# EAGLE design power (EAGLE 9.2.2)
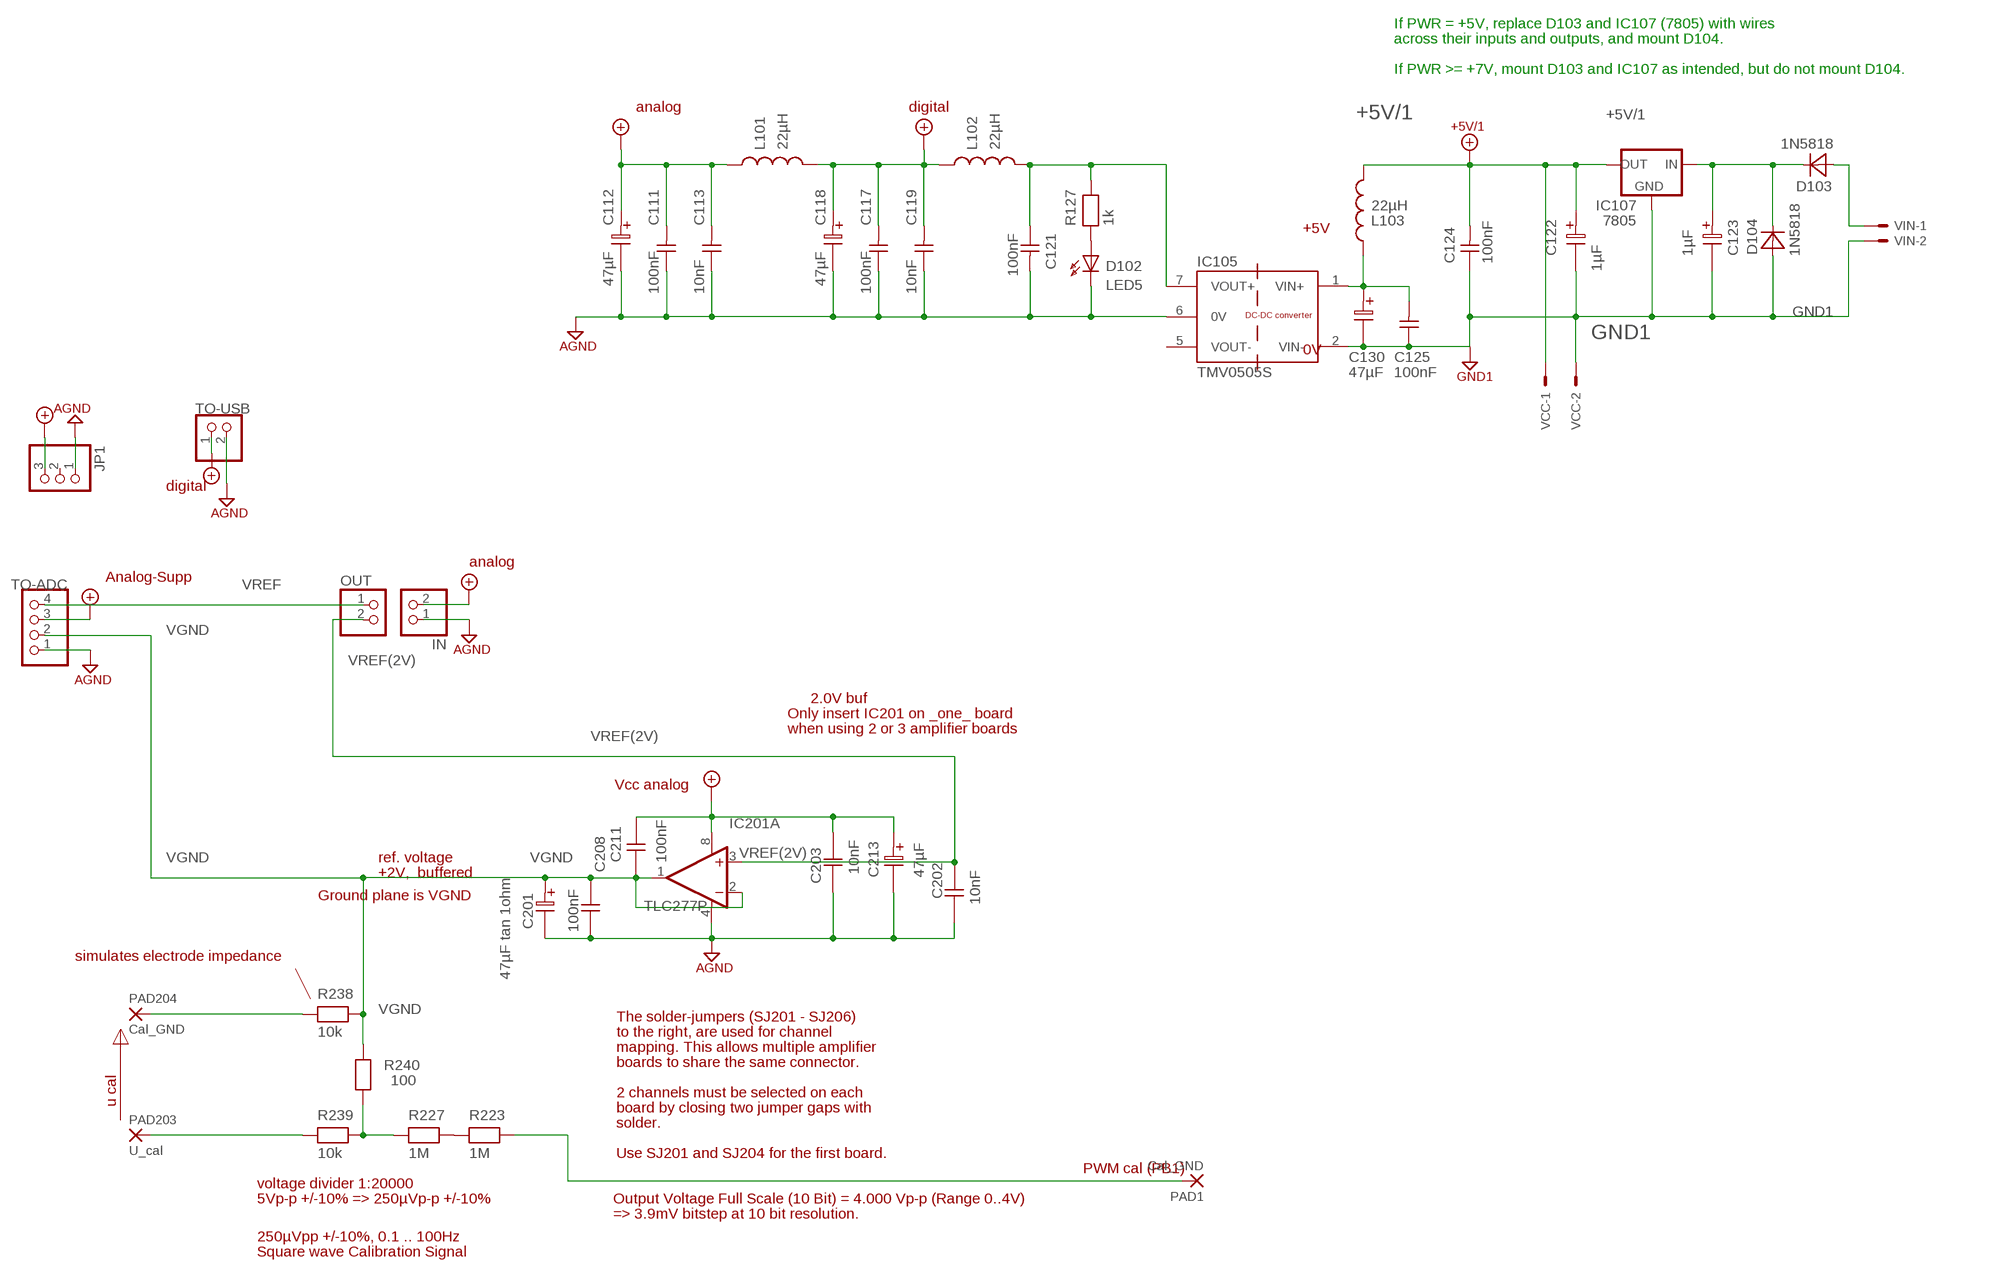
[diagram p0: schematic, sheet 1]

## Parts
C111  100nF  CAPNP-5  [C-5]
C112  47µF  ELC-5  [EL25B]
C113  10nF  CAPNP-5  [C-5]
C117  100nF  CAPNP-5  [C-5]
C118  47µF  ELC-5  [EL25B]
C119  10nF  CAPNP-5  [C-5]
C121  100nF  CAPNP-5@2  [C-5@1]
C122  1µF  ELC-2,5  [EL25B]
C123  1µF  ELC-2,5  [EL25B]
C124  100nF  CAPNP-5@2  [C-5@1]
C125  100nF  CAPNP-5  [C-5]
C130  47µF  ELC-5  [EL25B]
C201  47µF tan 1ohm  ELC-2,5  [EL25B]
C202  10nF  CAPNP-5@2  [C-5]
C203  10nF  CAPNP-7,5  [C-5]
C208  100nF  CAPNP-7,5  [C-5]
C211  100nF  CAPNP-5@2  [C-5]
C213  47µF  ELC-5  [EL25B]
D102  LED5  [LED5]
D103  1N5818  DIODE-12,5  [D-12,5]
D104  1N5818  DIODE-12,5  [D-12,5]
IC105  TMV0505S  MEJ2D0505SC  [MEJDCDC-SC]
IC107  7805  78XXS  [78XXL_S]
IC201  TLC277P  OPA2604AP  [DIL-08]
IN  PINHD-1X2  [1X02]
JP1  PINHD-1X3  [1X03]
L101  22µH  L-10  [R-12,5]
L102  22µH  L-10  [R-12,5]
L103  22µH  L-10  [R-12,5]
OUT  PINHD-1X2  [1X02]
PAD1  Cal_GND  1,6/0,8  [WIREPAD1]
PAD203  U_cal  1,6/0,8  [WIREPAD1]
PAD204  Cal_GND  1,6/0,8  [WIREPAD1]
R127  1k  RESEU-10@2  [R-10]
R223  1M  RESEU-10@2  [R-10]
R227  1M  RESEU-10@2  [R-10]
R238  10k  RESEU-7,5  [R-10]
R239  10k  RESEU-7,5  [R-10]
R240  100  RESEU-7,5  [R-10]
TO-ADC  PINHD-1X4  [1X04]
TO-USB  PINHD-1X2  [1X02]
VCC  87758-0216  [87758-0216]
VIN  22-23-2021  [22-23-2021]

## Nets
+5V/1: C122.1 C124.2 IC107.OUT L103.2 VCC.1
+6TO12V: C123.1 D103.2(K) D104.2(K) IC107.IN
A-VCC: C111.2 C112.1 C113.2 C203.1 C211.2 C213.1 IC201.8(A:V+) IN.2 L101.1 TO-ADC.3 ; supply symbol labelled +5V/2
D-VCC: C117.2 C118.1 C119.2 JP1.3 L101.2 L102.1 TO-USB.1 ; supply symbol labelled +5V/3
GND: C111.1 C112.2 C113.1 C117.1 C118.2 C119.1 C121.2 C201.2 C202.2 C203.2 C208.2 C213.2 D102.K IC105.6(0V) IC201.4(A:V-) IN.1 JP1.1 TO-ADC.1 TO-USB.2 ; supply symbol labelled AGND
GND1: C122.2 C123.2 C124.1 C125.1 C130.2 D104.1(A) IC105.2(VIN-) IC107.GND VCC.2 VIN.2
N$14: C121.1 IC105.7(VOUT+) L102.2 R127.2
N$15: D102.A R127.1
N$18: D103.1(A) VIN.1
N$30: PAD204.1(P) R238.1
N$34: R227.1 R239.2 R240.2
N$44: C125.2 C130.1 IC105.1(VIN+) L103.1
N$46: R223.1 R227.2
N$48: PAD203.1(P) R239.1
PWM: PAD1.1(P) R223.2
VGND: C201.1 C208.1 C211.1 IC201.1(A:OUT) IC201.2(A:-IN) R238.2 R240.1 TO-ADC.2
VREF: OUT.1 TO-ADC.4
VREF(2V): C202.1 IC201.3(A:+IN) OUT.2
Unconnected: IC201.5(B:+IN) IC201.6(B:-IN) IC201.7(B:OUT) JP1.2

## Notes on the sheet
- If PWR = +5V, replace D103 and IC107 (7805) with wires
- across their inputs and outputs, and mount D104.
- If PWR >= +7V, mount D103 and IC107 as intended, but do not mount D104.
- analog | digital
- +5V
- 0V
- digital
- analog
- Analog-Supp
- 2.0V buf
- Only insert IC201 on _one_ board
- when using 2 or 3 amplifier boards
- Vcc analog
- ref. voltage
- +2V,  buffered
- Ground plane is VGND
- simulates electrode impedance
- The solder-jumpers (SJ201 - SJ206)
- to the right, are used for channel
- mapping. This allows multiple amplifier
- boards to share the same connector.
- u cal
- 2 channels must be selected on each
- board by closing two jumper gaps with
- solder.
- Use SJ201 and SJ204 for the first board.
- PWM cal (PB1)
- voltage divider 1:20000
- 5Vp-p +/-10% => 250µVp-p +/-10% | Output Voltage Full Scale (10 Bit) = 4.000 Vp-p (Range 0..4V)
- => 3.9mV bitstep at 10 bit resolution.
- 250µVpp +/-10%, 0.1 .. 100Hz
- Square wave Calibration Signal

## Power pins joined to a net without a drawn wire
VOUT-: IC105.5(VOUT-)

## Library data of the parts
C111 C113 C117 C119 C125 = discrete:CAPNP-5
C112 C118 C130 = discrete:ELC-5
C121 C124 = discrete:CAPNP-5@2
C122 C123 = DISCRETE@2:ELC-2,5
C201 = DISCRETE@3:ELC-2,5
C202 C211 = DISCRETE:CAPNP-5@2
C203 C208 = DISCRETE:CAPNP-7,5
C213 = DISCRETE@2:ELC-5
D102 = led:LED5
D103 D104 = discrete:DIODE-12,5
IC105 = modEEG:MEJ2D0505SC
IC107 = V-REG@2:78XXS
IC201 = BURR:OPA2604AP
IN OUT TO-USB = pinhead:PINHD-1X2: PIN HEADER
JP1 = pinhead:PINHD-1X3: PIN HEADER
L101-L103 = DISCRETE@2:L-10
PAD1 PAD203 PAD204 = WIREPAD@2:1,6/0,8
R127 = discrete:RESEU-10@2
R223 R227 = DISCRETE:RESEU-10@2
R238-R240 = DISCRETE:RESEU-7,5
TO-ADC = pinhead:PINHD-1X4: PIN HEADER
VCC = con-molex:87758-0216: 2 Pin - 2mm Dual Row Single Wafer, Vertical T/H HDR Source: http://www.molex.com/pdm_docs/sd/877580616_sd.pdf; MF: MOLEX; MPN: 87758-0216; OC_FARNELL: unknown; OC_NEWARK: 94M1513
VIN = con-molex:22-23-2021: .100" (2.54mm) Center Header - 2 Pin; MF: MOLEX; MPN: 22-23-2021; OC_FARNELL: 1462926; OC_NEWARK: 25C3832

## Board
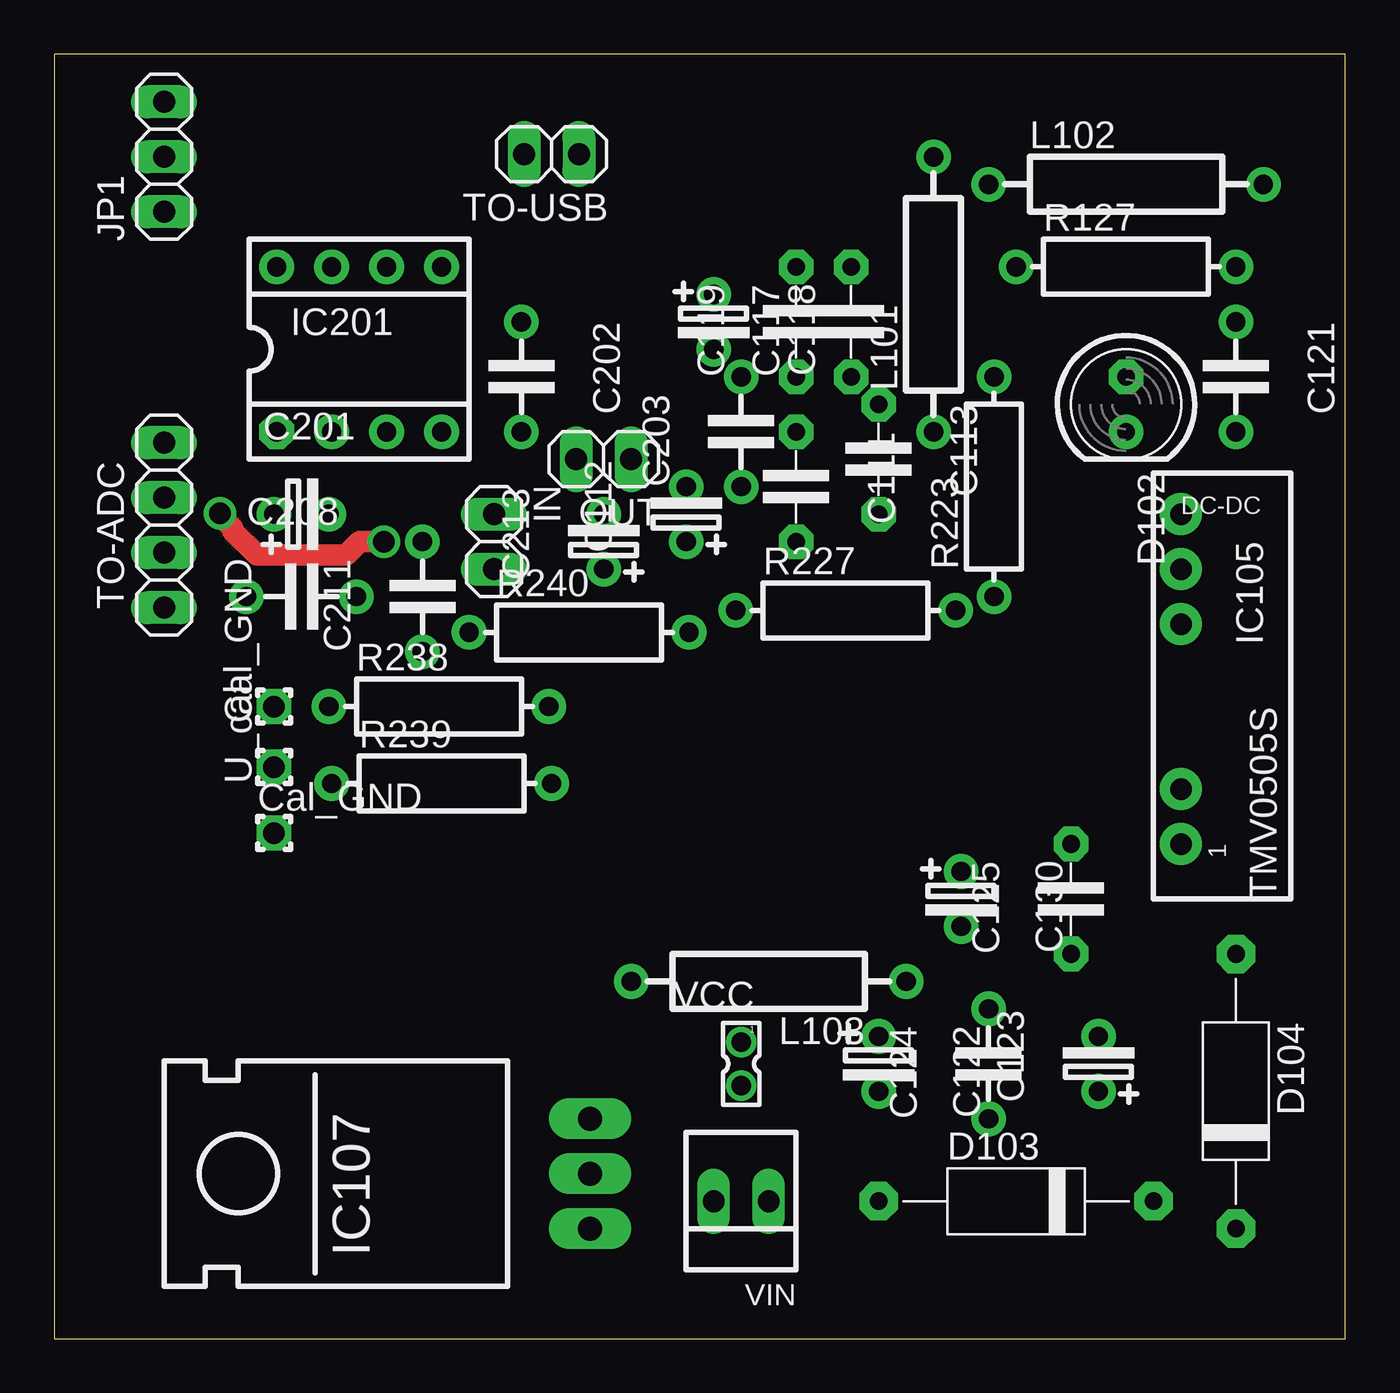
[diagram p1: board, top side]
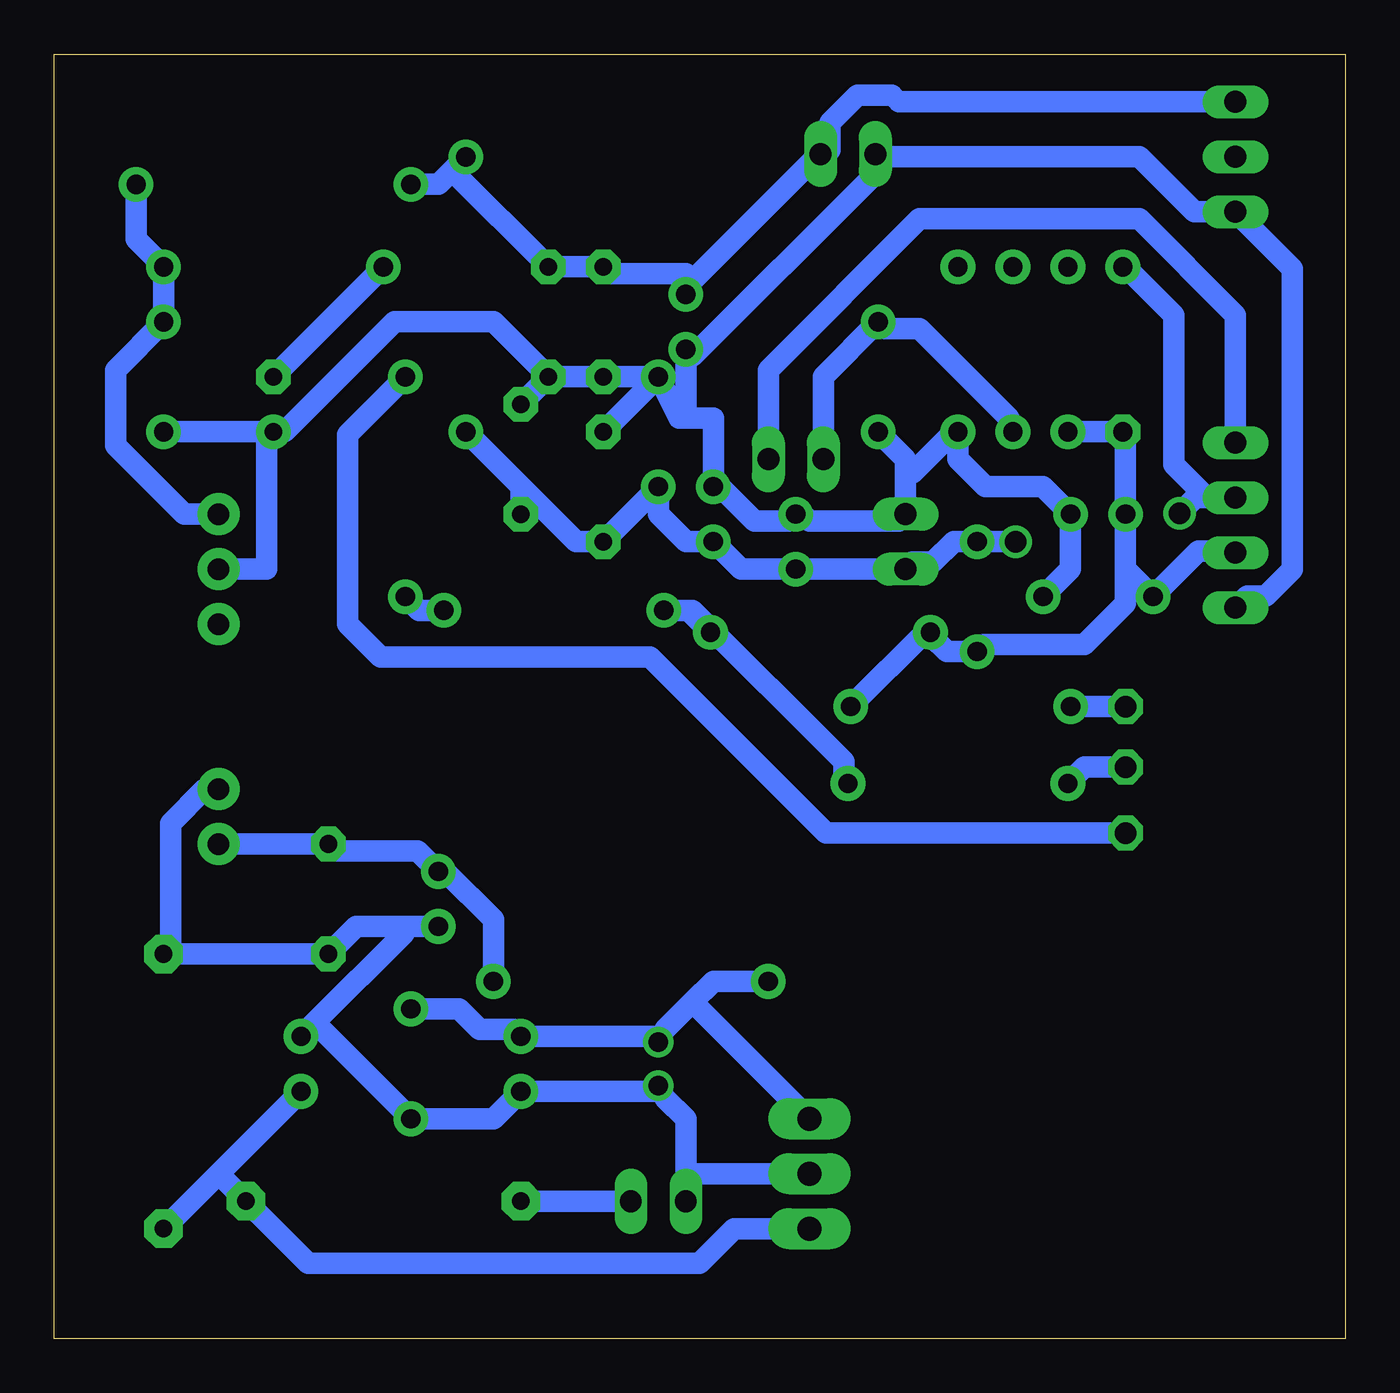
[diagram p2: board, bottom side, seen from below]

Size 59.67 x 59.36 mm. Coordinates in mm from the lower left corner, seen from the top.
Outline: 0,0 59.67,0 59.67,59.36 0,59.36 0,0
Copper layers (1*16): Top 0.035mm / dielectric 1.5mm / Bottom 0.035mm
Design rules "default *": minimum track width 1mm, minimum drill 0.35mm, track to track 1mm, track to pad 0.6mm, pad to pad 0.6mm, via to via 0.6mm, smd to smd 6mil, copper to edge 40mil, drill to drill 0.7mm, minimum pad ring 10mil, minimum via ring 8mil, stop-mask expansion 4mil, vias tented up to drill 0mil, thermal gap 10mil
tKeepout: 13 lines

### Footprints (pad centres in the part's own frame; a part is rotated, then mirrored left to right if it is on the bottom)
C-5 = drill 0.813 pad 1.6 octagon: 1 -2.54,0; 2 2.54,0
EL25B = drill 0.889 pad 1.6: 1 -1.27,0; 2 1.27,0
C-5@1 = drill 0.889 pad 1.6: 1 -2.54,0; 2 2.54,0
C-5' = drill 0.889 pad 1.6: 1 -2.54,0; 2 2.54,0
LED5 = drill 0.813 pad 1.6 octagon: A -1.27,0 | drill 0.813 pad 1.6: K 1.27,0
D-12,5 = drill 0.813 pad 1.778 octagon: 1 -6.35,0; 2 6.35,0
MEJDCDC-SC = drill 0.991 pad 1.93: 1 1.27,6.35; 2 1.27,3.81; 5 1.27,-3.81; 7 1.27,-8.89 | drill 1 pad 1.93: 6 1.27,-6.35
78XXL_S = drill 1.092 pad 1.905 long: GND 0,-0.635; IN -2.54,-0.635; OUT 2.54,-0.635
DIL-08 = drill 0.889 pad 1.6 octagon: 1 -3.81,-3.81 | drill 0.889 pad 1.6: 2 -1.27,-3.81; 3 1.27,-3.81; 4 3.81,-3.81; 5 3.81,3.81; 6 1.27,3.81; 7 -1.27,3.81; 8 -3.81,3.81
1X02 = drill 1.016 long: 1 -1.27,0; 2 1.27,0
1X03 = drill 1.016 long: 1 -2.54,0; 2 0,0; 3 2.54,0
R-12,5 = drill 0.889 pad 1.6: 1 -6.35,0; 2 6.35,0
WIREPAD1 = drill 0.991 pad 1.6 octagon: 1 0,0
R-10 = drill 0.889 pad 1.6: 1 -5.08,0; 2 5.08,0
1X04 = drill 1.016 long: 1 -3.81,0; 2 -1.27,0; 3 1.27,0; 4 3.81,0
87758-0216 = drill 0.9 pad 1.27: 1 0,-1; 2 0,1
22-23-2021 = drill 1 long: 1 -1.27,0; 2 1.27,0

### Placement (x,y rotation side)
C111  34.29,39.37 270 top
C112  29.21,38.1 90 top
C113  38.1,40.64 270 top
C117  36.83,46.99 90 top
C118  30.48,46.99 270 top
C119  34.29,46.99 90 top
C121  54.61,44.45 270 top
C122  38.1,12.7 270 top
C123  48.26,12.7 90 top
C124  43.18,12.7 90 top
C125  46.99,20.32 90 top
C130  41.91,20.32 270 top
C201  11.43,38.1 0 top
C202  10nF  [C-5']  21.59,44.45 270 top
C203  10nF  [C-5']  31.75,41.91 90 top
C208  100nF  [C-5']  11.43,34.29 0 top
C211  100nF  [C-5']  17.02,34.29 90 top
C213  25.4,36.83 90 top
D102  49.53,43.18 270 top
D103  44.45,6.35 0 top
D104  54.61,11.43 270 top
IC105  53.34,29.21 180 top
IC107  24.13,7.62 90 top
IC201  14.1,45.72 0 top
IN  20.32,36.83 270 top
JP1  5.08,54.61 90 top
L101  40.64,48.26 90 top
L102  49.53,53.34 0 top
L103  33.02,16.51 180 top
OUT  25.4,40.64 180 top
PAD1  10.16,23.37 0 top
PAD203  10.16,26.42 90 top
PAD204  10.16,29.21 90 top
R127  49.53,49.53 0 top
R223  43.43,39.37 90 top
R227  36.58,33.66 0 top
R238  17.78,29.21 0 top
R239  17.91,25.65 0 top
R240  24.26,32.64 0 top
TO-ADC  5.08,37.59 90 top
TO-USB  22.99,54.74 180 top
VCC  31.75,12.7 180 top
VIN  31.75,6.35 180 top

### Tracks (layer width: path | path; a pad name or v marks a point on that pad's centre or on a via)
+5V/1
  Bottom 1: C124.2 40.96,15.24 40.01,14.29 38.42,14.29 C122.1 31.75,13.97 VCC.1 31.43,14.29 30.16,15.56 | L103.2 29.21,16.51 30.16,15.56 | 30.16,15.56 IC107.OUT
+6TO12V
  Bottom 1: D104.2 52.07,7.62 | 52.07,7.62 C123.1 | 52.07,7.62 D103.2 47.94,3.49 29.84,3.49 28.26,5.08 IC107.IN
A-VCC  (via drill 1)
  Top 1: v15.24,36.83 14.12,36.83 13.49,36.2 9.37,36.2 8.26,37.31 8.26,37.46 7.62,38.1 v7.66,38.14
  Bottom 1: 6.41,38.86 7.94,40.39 7.94,47.31 10.16,49.53 IC201.8 | TO-ADC.3 6.41,38.86 | C113.2 38.1,39.37 L101.1 35.56,36.83 C111.2 C203.1 31.75,38.1 30.48,36.83 C112.1 27.94,35.56 C213.1 IN.2 20,35.88 19.05,35.88 18.1,36.83 C211.2 v15.24,36.83 | v7.66,38.14 6.93,38.86 6.41,38.86
D-VCC
  Bottom 1: L102.1 41.91,53.34 41.27,53.98 | L101.2 41.27,53.98 | 30.16,48.9 30.48,48.58 C118.1 | 30.16,48.9 24.45,54.61 TO-USB.1 23.81,54.93 23.81,56.2 22.54,57.47 20.95,57.47 20.64,57.15 JP1.3 | 30.16,48.9 30.48,49.21 33.97,49.21 C119.2 C117.2 41.27,53.98
GND
  Bottom 1: C208.2 12.7,35.56 C201.2 13.97,39.37 16.64,39.37 17.91,40.64 IC201.4 18.1,41.91 20,40.01 20.32,40.01 | 20.32,40.01 20.32,40.64 C202.2 | 20.32,40.01 IN.1 20.64,37.78 24.77,37.78 25.08,38.1 C213.2 25.72,37.78 27.3,37.78 28.89,39.37 C112.2 29.21,42.55 30.48,42.55 | 30.48,42.55 C118.2 30.16,45.4 21.91,53.66 21.91,54.29 TO-USB.2 21.59,54.61 9.53,54.61 6.99,52.07 JP1.1 2.46,49.45 2.46,35.55 3.69,34.32 4.54,34.32 TO-ADC.1 | C203.2 C119.1 C117.1 | C203.2 C111.1 | 30.48,42.55 30.8,42.55 C203.2 | C121.2 D102.K | D102.K 49.02,41.91 43.94,46.99 39.37,46.99 C117.1 | IC105.6 49.85,35.56 49.85,41.59 D102.K | C113.1 C117.1
GND1
  Bottom 1: IC107.GND 30.16,7.62 VIN.2 30.48,10.16 31.43,11.11 VCC.2 31.75,11.43 C122.2 39.37,10.16 C124.1 47.62,14.61 | 43.5,19.05 45.72,19.05 C125.1 D104.1 54.29,18.1 54.29,23.81 52.7,25.4 IC105.2 | 43.5,19.05 C130.2 | 47.62,14.61 43.5,18.73 43.5,19.05 | 47.62,14.61 C123.2
N$14
  Bottom 1: L102.2 55.88,50.8 R127.2 C121.1 56.83,44.77 56.83,41.27 53.66,38.1 IC105.7
N$15
  Bottom 1: R127.1 D102.A
N$18
  Bottom 1: D103.1 VIN.1
N$30
  Bottom 1: R238.1 PAD204.1
N$34
  Bottom 1: R239.2 23.18,25.72 23.18,26.67 30.16,33.66 R227.1 30.35,33.66 R240.2
N$44
  Bottom 1: IC105.1 C125.2 46.67,22.54 42.86,22.54 C130.1 41.59,21.59 39.37,19.37 L103.1
N$46
  Bottom 1: R223.1 42.8,33.66 R227.2
N$48
  Bottom 1: R239.1 12.06,26.42 PAD203.1
PWM
  Bottom 1: R223.2 46.1,41.78 46.1,33.02 44.58,31.5 32.13,31.5 24,23.37 PAD1.1
VGND
  Bottom 1: R238.2 19.37,32.7 R240.1 19.05,32.38 18.41,31.75 C211.1 16.7,32.07 12.06,32.07 10.16,33.97 C201.1 | IC201.2 IC201.1 10.16,41.59 C201.1 | TO-ADC.2 5.14,36.39 6.79,36.39 C208.1 10.16,35.56 C201.1
VREF
  Bottom 1: TO-ADC.4 5.08,47.31 9.53,51.75 19.68,51.75 26.67,44.77 OUT.1
VREF(2V)
  Bottom 1: OUT.2 24.13,44.45 C202.1 21.27,46.67 19.68,46.67 15.56,42.55 15.56,41.91 IC201.3